# Altium schematic sheet ethernet_dual_100mbe_ext_magn.SchDoc
size A4
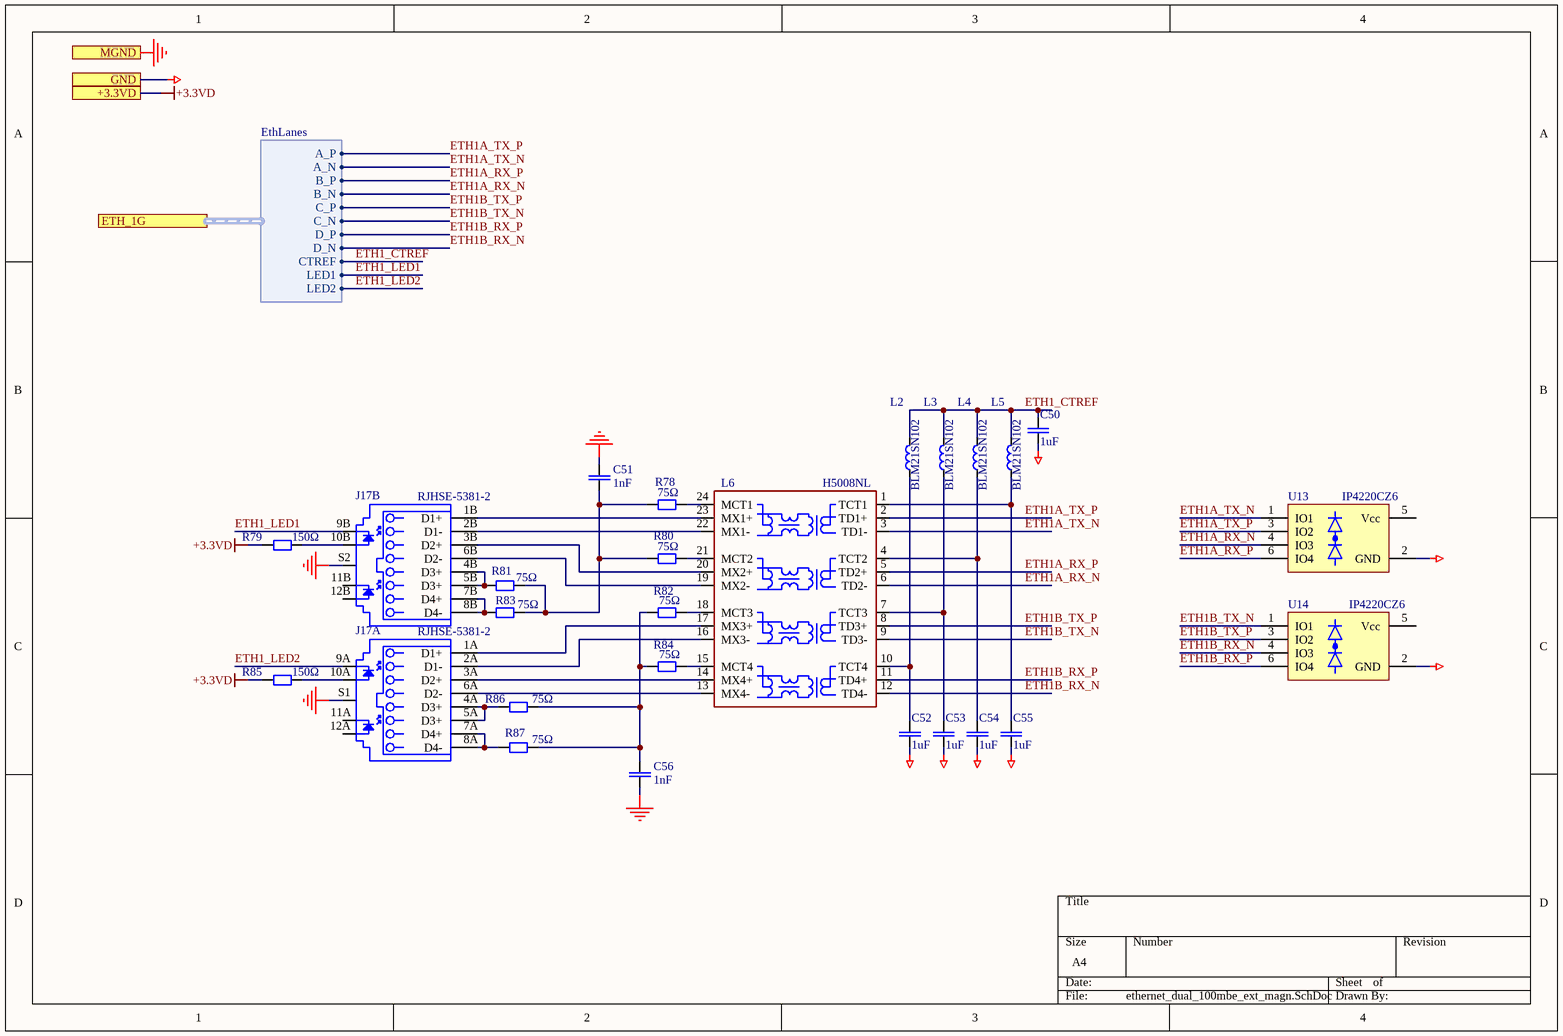
[diagram p0: ethernet_dual_100mbe_ext_magn.SchDoc]

## Parts
C50  1uF  [CAPC2012N]
C51  value 1nF  [CAPC3216N]  (hidden comment: 1nF; 2kV)
C52  1uF  [CAPC2012N]
C53  1uF  [CAPC2012N]
C54  1uF  [CAPC2012N]
C55  1uF  [CAPC2012N]
C56  value 1nF  [CAPC3216N]  (hidden comment: 1nF; 2kV)
J17  RJHSE-5381-2  [AMPH-RJHSE-5381-02_V]  (parts A,B of 2)
L2  value BLM21SN102  [INDC2012N]  (hidden comment: BLM21RK102SN1D)
L3  value BLM21SN102  [INDC2012N]  (hidden comment: BLM21RK102SN1D)
L4  value BLM21SN102  [INDC2012N]  (hidden comment: BLM21RK102SN1D)
L5  value BLM21SN102  [INDC2012N]  (hidden comment: BLM21RK102SN1D)
L6  H5008NL  [SMD_HX508]
R78  75Ω  [RESC2012N]
R79  150Ω  [RESC2012N]
R80  75Ω  [RESC2012N]
R81  75Ω  [RESC2012N]
R82  75Ω  [RESC2012N]
R83  75Ω  [RESC2012N]
R84  75Ω  [RESC2012N]
R85  150Ω  [RESC2012N]
R86  75Ω  [RESC2012N]
R87  75Ω  [RESC2012N]
U13  IP4220CZ6  [SOT95P285X110-6N]
U14  IP4220CZ6  [SOT95P285X110-6N]

## Ports
+3.3VD, ETH_1G (harness EthLanes), GND, MGND

## Harnesses
EthLanes: A_P, A_N, B_P, B_N, C_P, C_N, D_P, D_N, LED1, LED2, CTREF

## Nets
+3.3VD: R79.1 R85.1 ; port +3.3VD
GND: C50.1 C52.1 C53.1 C54.1 C55.1 U13.2(GND) U14.2(GND) ; port GND
MGND: C51.2 C56.1 J17.S1 J17.S2 ; port MGND
ETH1_CTREF: C50.2 L2.2 L3.2 L4.2 L5.2 ; port ETH_1G.CTREF
ETH1_LED1: J17.9B ; port ETH_1G.LED1
ETH1_LED2: J17.9A ; port ETH_1G.LED2
ETH1A_RX_N: L6.6(TD2-) U13.4(IO3) ; port ETH_1G.B_N
ETH1A_RX_P: L6.5(TD2+) U13.6(IO4) ; port ETH_1G.B_P
ETH1A_TX_N: L6.3(TD1-) U13.1(IO1) ; port ETH_1G.A_N
ETH1A_TX_P: L6.2(TD1+) U13.3(IO2) ; port ETH_1G.A_P
ETH1B_RX_N: L6.12(TD4-) U14.4(IO3) ; port ETH_1G.D_N
ETH1B_RX_P: L6.11(TD4+) U14.6(IO4) ; port ETH_1G.D_P
ETH1B_TX_N: L6.9(TD3-) U14.1(IO1) ; port ETH_1G.C_N
ETH1B_TX_P: L6.8(TD3+) U14.3(IO2) ; port ETH_1G.C_P
NetC51_1: C51.1 R78.1 R80.1 R81.2 R83.2
NetC52_2: C52.2 L2.1 L6.10(TCT4)
NetC53_2: C53.2 L3.1 L6.7(TCT3)
NetC54_2: C54.2 L4.1 L6.4(TCT2)
NetC55_2: C55.2 L5.1 L6.1(TCT1)
NetC56_2: C56.2 R82.1 R84.1 R86.2 R87.2
NetJ17_1A: J17.1A(D1+) L6.17(MX3+)
NetJ17_1B: J17.1B(D1+) L6.23(MX1+)
NetJ17_2A: J17.2A(D1-) L6.16(MX3-)
NetJ17_2B: J17.2B(D1-) L6.22(MX1-)
NetJ17_3A: J17.3A(D2+) L6.14(MX4+)
NetJ17_3B: J17.3B(D2+) L6.20(MX2+)
NetJ17_4A: J17.4A(D3+) J17.5A(D3+) R86.1
NetJ17_4B: J17.4B(D3+) J17.5B(D3+) R81.1
NetJ17_6A: J17.6A(D2-) L6.13(MX4-)
NetJ17_6B: J17.6B(D2-) L6.19(MX2-)
NetJ17_7A: J17.7A(D4+) J17.8A(D4-) R87.1
NetJ17_7B: J17.7B(D4+) J17.8B(D4-) R83.1
NetJ17_10A: J17.10A R85.2
NetJ17_10B: J17.10B R79.2
NetL6_15: L6.15(MCT4) R84.2
NetL6_18: L6.18(MCT3) R82.2
NetL6_21: L6.21(MCT2) R80.2
NetL6_24: L6.24(MCT1) R78.2

Not connected (* = marked no-connect by the designer): J17 11A(11) 11B(11) 12A(12) 12B(12); U13 5(Vcc); U14 5(Vcc)

## Library data of the parts
C50 C52-C55 = CAPC: Generic ceramic SMD capacitor; Pkg: 0805; Maintainer: Evgeniy Kotov; SMD Solders: 2; THD Solders: 0; Voltage Rating: 10V; PartField: 1uF; Last Change Data: 06.03.2017; Release Date: 06.03.2017; Value: 1uF
C51 C56 = CAPC: Generic ceramic SMD capacitor; Pkg: 1206; Maintainer: Evgeniy Kotov; SMD Solders: 2; THD Solders: 0; PartField: 1nF; Last Change Data: 06.03.2017; Release Date: 06.03.2017; VoltageRating: 2kV
J17 = RJ45-RJHSE-5381-2: Dual Port, High Speed RJ45, Modular Jack, 8 Position, 8 Contacts, Shielded, with LEDs, -55 to 85 degC,12-Pin THD, RoHS, Tray; Manufacturer: Amphenol; Number of Positions/Contacts: 8p8c(RJ45,Ethernet); Number of Ports: 1; Catalog Drawings: RJ45SeriesRightAngle; PCN Design/Specification: MultipleSeriesCopper29/Jan/2009RJHSEShieldMaterial30/Jun/2015; Other Names: RJHSE5381; Online Catalog: RJHSESeries; Featured Product: ModularJacksProductSolutions; Tab Direction: Up; Shielding: Shielded,EMIFinger; LED Color: Yellow-Green; 3D Model: RJHSE538x.stpRJHSE538x.igs; Pkg: LAN x2; SMD Solders: 0; THD Solders: 28; Category: Connectors,Interconnects; Termination: Solder; Housing Material: Thermoplastic; Mounting Type: ThroughHole; Family: ModularConnectors-Jacks; Orientation: 90°Angle(Right); Features: BoardLock; Contact Material: PhosphorBronze; Mounting Technology: ThroughHole; Number of Rows: 1; Standard Package: 120; Ratings: -; Operating Temperature: -55°C~85°C; Series: RJHSE; Contact Finish: Gold; Package Reference: RJHSE-5381; Ingress Protection: -; Package Description: 12-Pin Through Hole Device, Body 16.51 x 15.75 mm; Contact Finish Thickness: 50µin(1.27µm); Datasheet URL: https://datasheet.ciiva.com/16481/rjhse538x-16481714.pdf; Datasheet Version: Rev. K, 04/2014; Connector Type: Jack; Manufacturer URL: http://www.amphenol.com/; Packaging: Tray; PartField: RJHSE-5381-2; Value: RJHSE-5381-2
L2-L5 = BLM21RK102SN1D: Ferrite Beads, 0805, 1 kOhm; Pkg: 0805; Vendor: Murata; Maintainer: Evgeniy Kotov; SMD Solders: 2; THD Solders: 0; DC Current: 200mA; Tolerance: 25%; DC Resistance: 500mΩ; PartField: BLM21RK102SN1D; Release Date: 30.03.2017; Last Change Data: 30.03.2017; Temperature Range: -55°C to +125°C
L6 = LAN_1G_TR_H5008NL: LAN Transformer fog 1GbE, 12 coils, 4 pairs.; Vendor: Pulse Electronics; Maintainer: Evgeniy Kotov; SMD Solders: 2; THD Solders: 0; Tolerance: 2%; PartField: H5008NL; Pkg: H5008NL; Release Date: 31.03.2017; Last Change Data: 31.03.2017; Temperature Range: -25°C to +85°C; Value: H5008NL
R78-R87 = RESC: Resistor, Generic, SMD; Pkg: 0805; Maintainer: Evgeniy Kotov; SMD Solders: 2; THD Solders: 0; Release Date: 06.03.2017; Last Change Data: 09.03.2017
  R78 R80-R84 R86 R87: PartField: 75Ω; Value: 75Ω
  R79 R85: PartField: 150Ω; Value: 150Ω
U13 U14 = IP4220CZ6: Transimpedance Amplifier; Selectable-Feedback Resistance; Pkg: SOT457; SMD Solders: 6; THD Solders: 0; Maintainer: Evgeniy Kotov; Vendor: NXP; PartField: IP4220CZ6; ComponentLink1URL: http://assets.nexperia.com/documents/data-sheet/IP4220CZ6.pdf; ComponentLink1Description: Datasheet; Last Change Date: 28.03.2017; Release Date: 28.03.2017; Value: IP4220CZ6